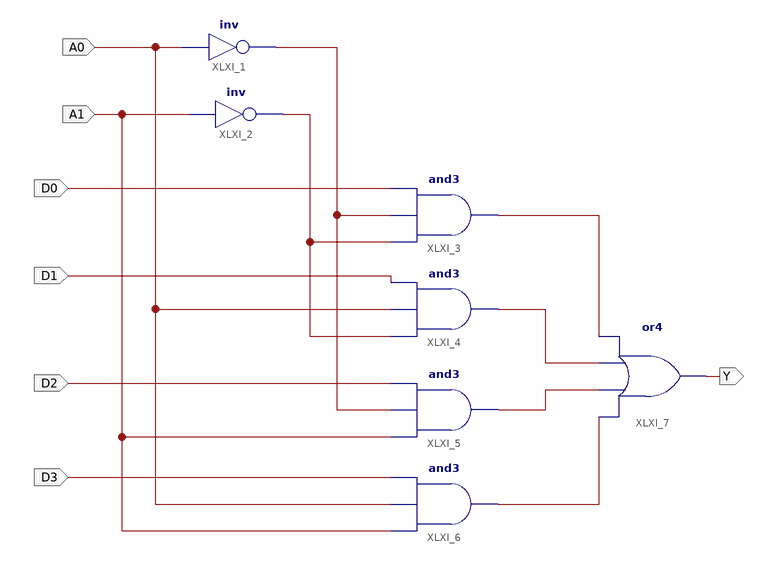
[diagram p0: schematic sheet 1]
// Xilinx ISE schematic lab53b.sch (artix7) as structural Verilog: 7 symbols, 7 ports
module lab53b (
  input  A0,
  input  A1,
  input  D0,
  input  D1,
  input  D2,
  input  D3,
  output Y
);

  wire XLXN_1, XLXN_2, XLXN_3, XLXN_4, XLXN_5, XLXN_7;

  not XLXI_1 (XLXN_5, A0);
  not XLXI_2 (XLXN_7, A1);
  and XLXI_3 (XLXN_1, XLXN_7, XLXN_5, D0);
  and XLXI_4 (XLXN_2, XLXN_7, A0, D1);
  and XLXI_5 (XLXN_3, A1, XLXN_5, D2);
  and XLXI_6 (XLXN_4, A1, A0, D3);
  or XLXI_7 (Y, XLXN_4, XLXN_3, XLXN_2, XLXN_1);
endmodule
